# EAGLE schematic wr841n-pic (EAGLE 6.5.0)
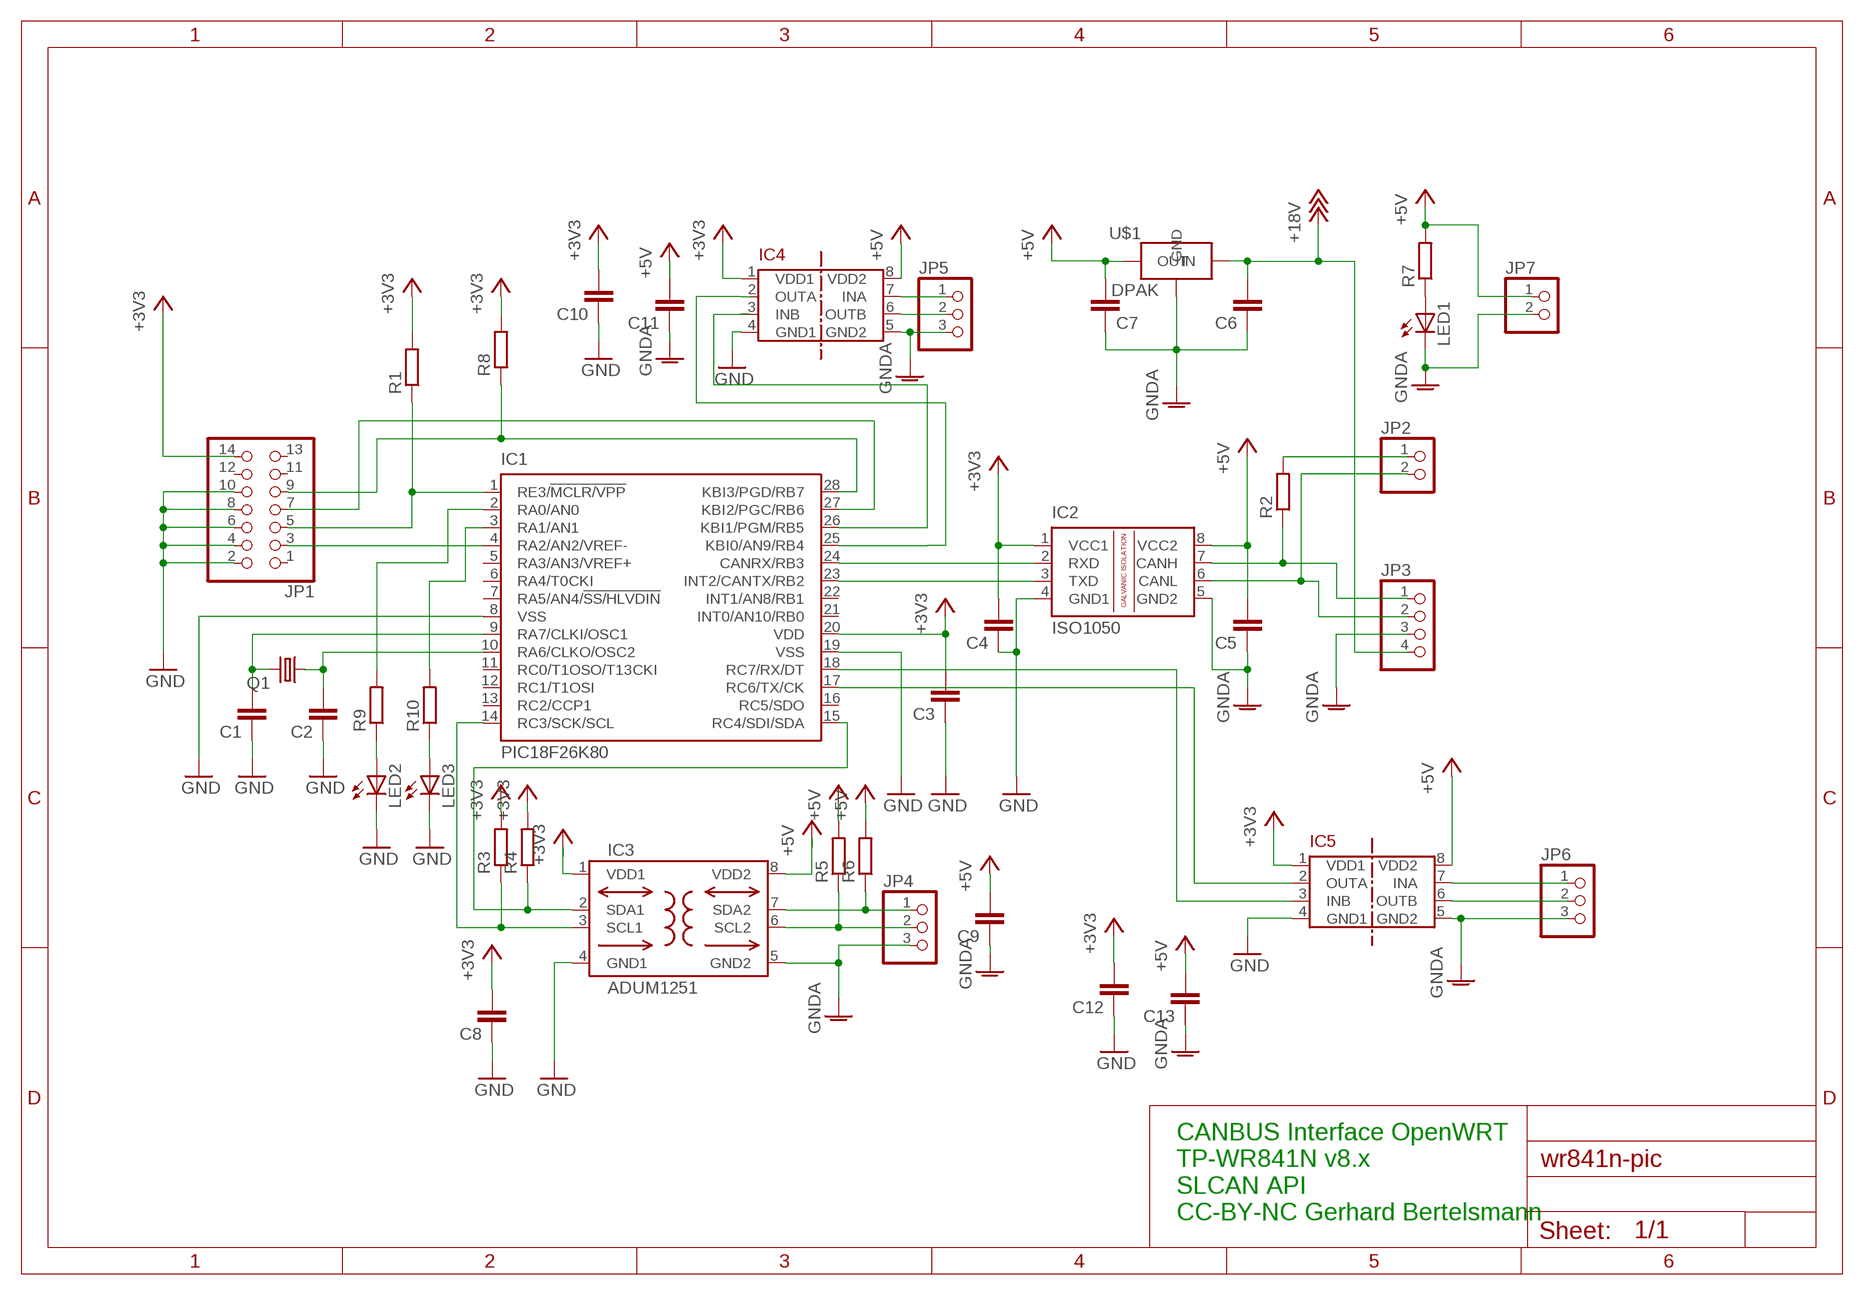
[diagram p0: schematic, sheet 1]

## Parts
C1  C-EUC1206  [C1206]
C2  C-EUC1206  [C1206]
C3  C-EUC1206  [C1206]
C4  C-EUC1206  [C1206]
C5  C-EUC1206  [C1206]
C6  C-EUC1206  [C1206]
C7  C-EUC1206  [C1206]
C8  C-EUC1206  [C1206]
C9  C-EUC1206  [C1206]
C10  C-EUC1206  [C1206]
C11  C-EUC1206  [C1206]
C12  C-EUC1206  [C1206]
C13  C-EUC1206  [C1206]
IC1  PIC18F26K80  PIC18F26K80-E/SO  [SO28W]
IC2  ISO1050  ISO1050DUB  [DUB-R-PDSO-G8]
IC3  ADUM1251  [SO8-COOL]
IC4  ADUM1201  [SO8]
IC5  ADUM1201  [SO8]
JP1  PINHD-2X7  [2X07]
JP2  PINHD-1X2  [1X02]
JP3  PINHD-1X4  [1X04]
JP4  PINHD-1X3  [1X03]
JP5  PINHD-1X3  [1X03]
JP6  PINHD-1X3  [1X03]
JP7  PINHD-1X2  [1X02]
LED1  LEDCHIPLED_1206  [CHIPLED_1206]
LED2  LEDCHIPLED_1206  [CHIPLED_1206]
LED3  LEDCHIPLED_1206  [CHIPLED_1206]
Q1  CRYSTALHC49UP  [HC49UP]
R1  R-EU_R1206  [R1206]
R2  R-EU_R1206  [R1206]
R3  R-EU_R1206  [R1206]
R4  R-EU_R1206  [R1206]
R5  R-EU_R1206  [R1206]
R6  R-EU_R1206  [R1206]
R7  R-EU_R1206  [R1206]
R8  R-EU_R1206  [R1206]
R9  R-EU_R1206  [R1206]
R10  R-EU_R1206  [R1206]
U$1  7805-DPAK  [7805-DPAK]

## Nets
+3V3: C3.2 C4.2 C8.2 C10.2 C12.2 IC1.20(VDD) IC2.1(VCC1) IC3.1(VDD1) IC4.1(VDD1) IC5.1(VDD1) JP1.14 R1.2 R3.2 R4.2 R8.2
+5V: C5.2 C7.2 C9.2 C11.2 C13.2 IC2.8(VCC2) IC3.8(VDD2) IC4.8(VDD2) IC5.8(VDD2) JP7.1 R5.2 R6.2 R7.2 U$1.OUT
+18V: C6.2 JP3.4 U$1.IN
GND: C1.1 C2.1 C3.1 C4.1 C8.1 C10.1 C12.1 IC1.8(VSS) IC1.19(VSS) IC2.4(GND1) IC3.4(GND1) IC4.4(GND1) IC5.4(GND1) JP1.2 JP1.4 JP1.6 JP1.8 JP1.10 LED2.C LED3.C
GNDA: C5.1 C6.1 C7.1 C9.1 C11.1 C13.1 IC2.5(GND2) IC3.5(GND2) IC4.5(GND2) IC5.5(GND2) JP3.3 JP4.3 JP5.3 JP6.3 JP7.2 LED1.C U$1.GND
N$1: C1.2 IC1.9(RA7/CLKI/OSC1) Q1.2
N$2: C2.2 IC1.10(RA6/CLKO/OSC2) Q1.1
N$3: IC1.1(RE3/!MCLR/VPP) JP1.5 R1.1
N$4: IC1.28(KBI3/PGD/RB7) JP1.9 R8.1
N$5: IC1.27(KBI2/PGC/RB6) JP1.7
N$6: IC1.24(CANRX/RB3) IC2.2(RXD)
N$7: IC1.23(INT2/CANTX/RB2) IC2.3(TXD)
N$8: IC2.7(CANH) JP3.1 R2.1
N$9: JP2.1 R2.2
N$10: IC2.6(CANL) JP2.2 JP3.2
N$11: IC3.7(SDA2) JP4.1 R6.1
N$12: IC3.6(SCL2) JP4.2 R5.1
N$13: IC1.14(RC3/SCK/SCL) IC3.3(SCL1) R3.1
N$14: IC1.15(RC4/SDI/SDA) IC3.2(SDA1) R4.1
N$15: LED1.A R7.1
N$16: IC1.3(RA1/AN1) R10.2
N$17: IC4.7(INA) JP5.1
N$18: IC4.6(OUTB) JP5.2
N$19: IC1.17(RC6/TX/CK) IC5.2(OUTA)
N$20: IC5.7(INA) JP6.1
N$21: IC5.6(OUTB) JP6.2
N$22: IC1.18(RC7/RX/DT) IC5.3(INB)
N$25: IC1.4(RA2/AN2/VREF-) JP1.3
N$27: IC1.26(KBI1/PGM/RB5) IC4.3(INB)
N$28: IC1.25(KBI0/AN9/RB4) IC4.2(OUTA)
N$29: IC1.2(RA0/AN0) R9.2
N$30: LED2.A R9.1
N$31: LED3.A R10.1
Unconnected: IC1.5(RA3/AN3/VREF+) IC1.6(RA4/T0CKI) IC1.7(RA5/AN4/!SS/HLVDIN) IC1.11(RC0/T1OSO/T13CKI) IC1.12(RC1/T1OSI) IC1.13(RC2/CCP1) IC1.16(RC5/SDO) IC1.21(INT0/AN10/RB0) IC1.22(INT1/AN8/RB1) JP1.1 JP1.11 JP1.12 JP1.13

## Notes on the sheet
- CANBUS Interface OpenWRT
  TP-WR841N v8.x
  SLCAN API
  CC-BY-NC Gerhard Bertelsmann

## Library data of the parts
C1-C13 = resistor:C-EU: CAPACITOR, European symbol
IC1 = PIC18F26K80:PIC18F26K80: 28-Pin Enhanced Flash Microcontrollers with ECAN(TM) Technology 10-Bit A/D and nanoWatt Technology Source: http://www.microchip.com .. 39637a.pdf
IC2 = texas:ISO1050: ISOLATED CAN TRANSCEIVER Source: http://focus.ti.com/lit/ds/symlink/iso1050.pdf; MPN: ISO1050DUBR; OC_FARNELL: 1755712; OC_NEWARK: 14R9899
IC3 = analog-devices-3:ADUM1251
IC4 IC5 = Bus-isolators:ADUM1201
JP1 = pinhead:PINHD-2X7: PIN HEADER
JP2 JP7 = pinhead:PINHD-1X2: PIN HEADER
JP3 = pinhead:PINHD-1X4: PIN HEADER
JP4-JP6 = pinhead:PINHD-1X3: PIN HEADER
LED1-LED3 = led:LED: LED OSRAM: - CHIPLED LG R971, LG N971, LY N971, LG Q971, LY Q971, LO R971, LY R971 LH N974, LH R974 LS Q976, LO Q976, LY Q976 LO Q996 - Hyper CHIPLED LW Q18S LB Q993, LB Q99A, LB R99A - SideLED LS A670, LO A670, LY A670, LG A670, LP A670 LB A673, LV A673, LT A673, LW A673 LH A674 LY A675 LS A676, LA A676, LO A676, LY A676, LW A676 LS A679, LY A679, LG A679 - Hyper Micro SIDELED® LS Y876, LA Y876, LO Y876, LY Y876 LT Y87S - SmartLED LW L88C, LW L88S LB L89C, LB L89S, LG L890 LS L89K, LO L89K, LY L89K LS L896, LA L896, LO L896, LY L896 - TOPLED LS T670, LO T670, LY T670, LG T670, LP T670 LSG T670, LSP T670, LSY T670, LOP T670, LYG T670 LG T671, LOG T671, LSG T671 LB T673, LV T673, LT T673, LW T673 LH T674 LS T676, LA T676, LO T676, LY T676, LB T676, LH T676, LSB T676, LW T676 LB T67C, LV T67C, LT T67C, LS T67K, LO T67K, LY T67K, LW E67C LS E67B, LA E67B, LO E67B, LY E67B, LB E67C, LV E67C, LT E67C LW T67C LS T679, LY T679, LG T679 LS T770, LO T770, LY T770, LG T770, LP T770 LB T773, LV T773, LT T773, LW T773 LH T774 LS E675, LA E675, LY E675, LS T675 LS T776, LA T776, LO T776, LY T776, LB T776 LHGB T686 LT T68C, LB T68C - Hyper Mini TOPLED® LB M676 - Mini TOPLED Santana® LG M470 LS M47K, LO M47K, LY M47K Source: http://www.osram.convergy.de LUXEON: - LUMILED® LXK2-PW12-R00, LXK2-PW12-S00, LXK2-PW14-U00, LXK2-PW14-V00 LXK2-PM12-R00, LXK2-PM12-S00, LXK2-PM14-U00 LXK2-PE12-Q00, LXK2-PE12-R00, LXK2-PE12-S00, LXK2-PE14-T00, LXK2-PE14-U00 LXK2-PB12-K00, LXK2-PB12-L00, LXK2-PB12-M00, LXK2-PB14-N00, LXK2-PB14-P00, LXK2-PB14-Q00 LXK2-PR12-L00, LXK2-PR12-M00, LXK2-PR14-Q00, LXK2-PR14-R00 LXK2-PD12-Q00, LXK2-PD12-R00, LXK2-PD12-S00 LXK2-PH12-R00, LXK2-PH12-S00 LXK2-PL12-P00, LXK2-PL12-Q00, LXK2-PL12-R00 Source: www.luxeon.com KINGBRIGHT: KA-3528ASYC Source: www.kingbright.com
Q1 = crystal:CRYSTAL: CRYSTAL; OC_FARNELL: unknown; OC_NEWARK: unknown
R1-R10 = resistor:R-EU_: RESISTOR, European symbol
U$1 = vreg-7805-dpak:7805-DPAK